# Altium schematic sheet IMU.SchDoc
size A4
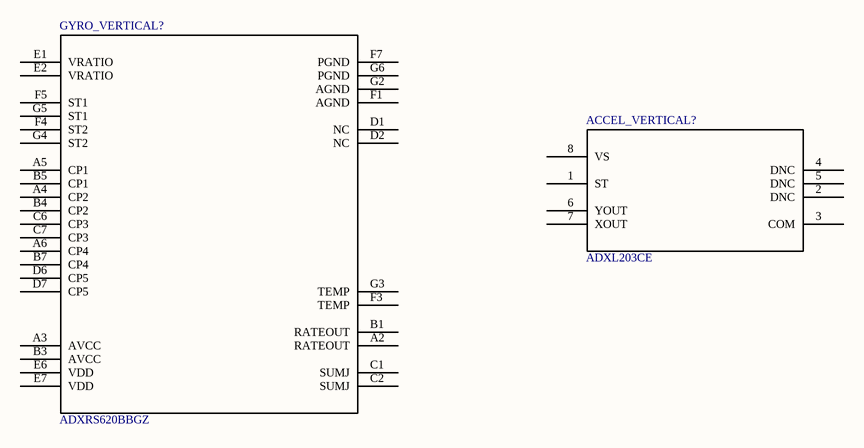
[diagram p0: IMU.SchDoc]

## Parts
ACCEL_VERTICAL?  ADXL203CE  [ADXL203]
GYRO_VERTICAL?  ADXRS620BBGZ  [BG_32_3]

## Nets

Not connected (* = marked no-connect by the designer): ACCEL_VERTICAL? 1(ST) 2(DNC) 3(COM) 4(DNC) 5(DNC) 6(YOUT) 7(XOUT) 8(VS); GYRO_VERTICAL? A2(RATEOUT) A3(AVCC) A4(CP2) A5(CP1) A6(CP4) B1(RATEOUT) B3(AVCC) B4(CP2) B5(CP1) B7(CP4) C1(SUMJ) C2(SUMJ) C6(CP3) C7(CP3) D1(NC) D2(NC) D6(CP5) D7(CP5) E1(VRATIO) E2(VRATIO) E6(VDD) E7(VDD) F1(AGND) F3(TEMP) F4(ST2) F5(ST1) F7(PGND) G2(AGND) G3(TEMP) G4(ST2) G5(ST1) G6(PGND)

## Library data of the parts
ACCEL_VERTICAL? = ADXL203CE: Imported; RefDes: RefDes; Type: DEV; Value: Value
GYRO_VERTICAL? = ADXRS620BBGZ: Imported; Manufacturer_Part_Number: ADXRS613BBGZ; Vendor: Vendor; RefDes: RefDes; Type: DEV; Value: Value